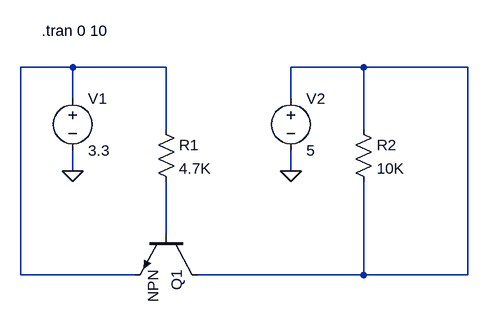
[diagram p0: schematic LevelShift3vTo5v.asc]
LevelShift3vTo5v.asc, the LTspice schematic file:
Version 4
SHEET 1 880 680
WIRE 48 96 -32 96
WIRE 192 96 48 96
WIRE 496 96 384 96
WIRE 656 96 496 96
WIRE 48 144 48 96
WIRE 384 144 384 96
WIRE 192 192 192 96
WIRE 496 192 496 96
WIRE 48 256 48 224
WIRE 384 256 384 224
WIRE 192 352 192 272
WIRE -32 416 -32 96
WIRE 144 416 -32 416
WIRE 496 416 496 272
WIRE 496 416 240 416
WIRE 656 416 656 96
WIRE 656 416 496 416
FLAG 48 256 0
FLAG 384 256 0
SYMBOL res 176 176 R0
SYMATTR InstName R1
SYMATTR Value 4.7K
SYMBOL res 480 176 R0
SYMATTR InstName R2
SYMATTR Value 10K
SYMBOL npn 240 352 R90
SYMATTR InstName Q1
SYMBOL voltage 48 128 R0
SYMATTR InstName V1
SYMATTR Value 3.3
SYMBOL voltage 384 128 R0
SYMATTR InstName V2
SYMATTR Value 5
TEXT 0 40 Left 2 !.tran 0 10

The netlist it stands for:
* LevelShift3vTo5v.asc
R1 N001 N003 4.7K
R2 N002 N002 10K
Q1 N002 N003 N001 0 NPN
V1 N001 0 3.3
V2 N002 0 5
.model NPN NPN
.model PNP PNP
.lib standard.bjt
.tran 0 10
.backanno
.end